# EAGLE design bilancia_smart_no_route (EAGLE 7.1.0)
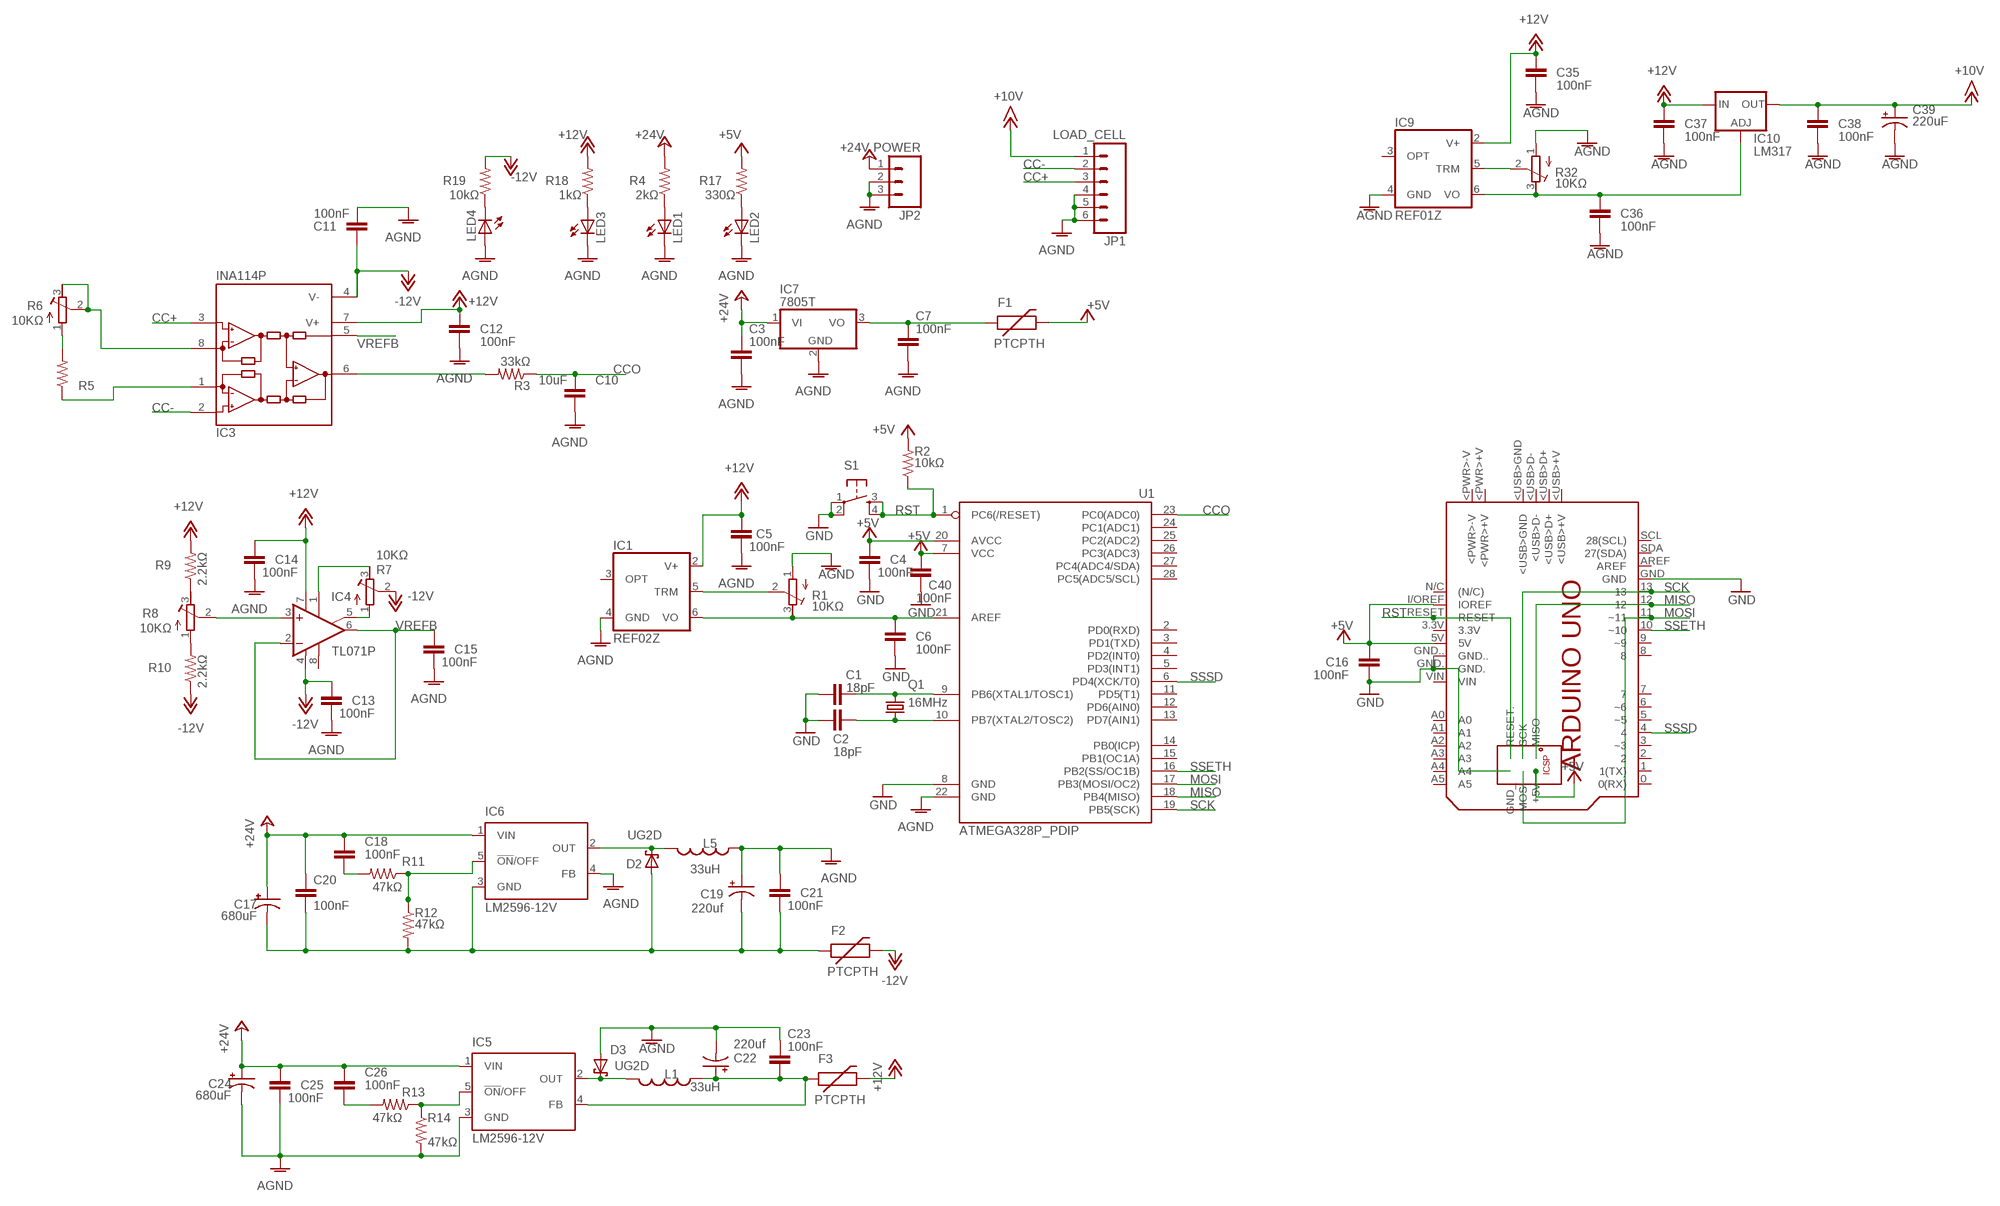
[diagram p0: schematic, sheet 1]

## Parts
C1  18pF  C2.5/2  [C2.5-2]
C2  18pF  C2.5/2  [C2.5-2]
C3  100nF  C2.5/2  [C2.5-2]
C4  100nF  C2.5/2  [C2.5-2]
C5  100nF  C2.5/2  [C2.5-2]
C6  100nF  C2.5/2  [C2.5-2]
C7  100nF  C2.5/2  [C2.5-2]
C10  10uF  C2.5/2  [C2.5-2]
C11  100nF  C2.5/2  [C2.5-2]
C12  100nF  C2.5/2  [C2.5-2]
C13  100nF  C2.5/2  [C2.5-2]
C14  100nF  C2.5/2  [C2.5-2]
C15  100nF  C2.5/2  [C2.5-2]
C16  100nF  C2.5/2  [C2.5-2]
C17  680uF  CPOL-USE5-8.5  [E5-8,5]
C18  100nF  C2.5/2  [C2.5-2]
C19  220uf  CPOL-USE5-8.5  [E5-8,5]
C20  100nF  C2.5/2  [C2.5-2]
C21  100nF  C2.5/2  [C2.5-2]
C22  220uf  CPOL-USE5-8.5  [E5-8,5]
C23  100nF  C2.5/2  [C2.5-2]
C24  680uF  CPOL-USE5-8.5  [E5-8,5]
C25  100nF  C2.5/2  [C2.5-2]
C26  100nF  C2.5/2  [C2.5-2]
C35  100nF  C2.5/2  [C2.5-2]
C36  100nF  C2.5/2  [C2.5-2]
C37  100nF  C2.5/2  [C2.5-2]
C38  100nF  C2.5/2  [C2.5-2]
C39  220uF  CAP_POLPTH1  [CPOL-RADIAL-100UF-25V]
C40  100nF  C2.5/2  [C2.5-2]
D2  UG2D  SCHOTTKY-DIODEDO41-7  [DO41-7]
D3  UG2D  SCHOTTKY-DIODEDO41-7  [DO41-7]
F1  PTCPTH  [PTC]
F2  PTCPTH  [PTC]
F3  PTCPTH  [PTC]
IC1  REF02Z  [DIL08]
IC3  INA114P  [DIL08]
IC4  TL071P  [DIL08]
IC5  LM2596-12V  LM2596T  [T05D]
IC6  LM2596-12V  LM2596T  [T05D]
IC7  7805T  [TO220H]
IC9  REF01Z  [DIL08]
IC10  LM317  LM317TS  [317TS]
JP1  LOAD_CELL  M06SIP  [1X06]
JP2  POWER  M03PTH  [1X03]
L1  33uH  INDUCTORRLB0912  [RLB0912]
L5  33uH  INDUCTORRLB0912  [RLB0912]
LED1  MINIMIDI_LED5MM  [MINIMIDI_LED5MM]
LED2  MINIMIDI_LED5MM  [MINIMIDI_LED5MM]
LED3  MINIMIDI_LED5MM  [MINIMIDI_LED5MM]
LED4  MINIMIDI_LED5MM  [MINIMIDI_LED5MM]
PCB1  ARDUINO_UNO  [ARDUINO_UNO]
Q1  16MHz  CRYSTALHC49S  [HC49/S]
R1  10KΩ  R-TRIMM64W  [RTRIM64W]
R2  10kΩ  R-US_0207/10  [0207/10]
R3  33kΩ  R-US_0207/10  [0207/10]
R4  2kΩ  R-US_0207/10  [0207/10]
R5  R-US_0207/10  [0207/10]
R6  10KΩ  R-TRIMM64W  [RTRIM64W]
R7  10KΩ  R-TRIMM64W  [RTRIM64W]
R8  10KΩ  R-TRIMM64W  [RTRIM64W]
R9  2.2kΩ  R-US_0207/10  [0207/10]
R10  2.2kΩ  R-US_0207/10  [0207/10]
R11  47kΩ  R-US_0207/2V  [0207/2V]
R12  47kΩ  R-US_0207/2V  [0207/2V]
R13  47kΩ  R-US_0207/2V  [0207/2V]
R14  47kΩ  R-US_0207/2V  [0207/2V]
R17  330Ω  R-US_0207/10  [0207/10]
R18  1kΩ  R-US_0207/10  [0207/10]
R19  10kΩ  R-US_0207/10  [0207/10]
R32  10KΩ  R-TRIMM64W  [RTRIM64W]
S1  TAC_SWITCHPTH  [TACTILE-PTH]
U1  ATMEGA328P_PDIP  [DIL28-3]

## Nets
+5V: C4.2 C16.2 C40.2 F1.P$2 PCB1.5V PCB1.+5V PCB1.I/OREF(IOREF) R2.2 R17.2 U1.7(VCC) U1.20(AVCC)
+12V: C5.1 C12.2 C14.2 C35.2 C37.2 F3.P$2 IC1.2(V+) IC3.7(V+) IC4.7(V+) IC9.2(V+) IC10.3(IN) R9.2 R18.2
+15V: C38.2 C39.1(+) IC10.2(OUT) JP1.1 ; supply symbol labelled +10V
+24V: C3.2 C17.+ C18.1 C20.1 C24.+ C25.1 C26.1 IC5.1(VIN) IC6.1(VIN) IC7.1(VI) JP2.1 R4.2
-12V: C11.2 C13.2 F2.P$2 IC3.4(V-) IC4.4(V-) R7.2(S) R10.1 R19.2
AGND: C3.1 C5.2 C7.1 C10.1 C11.1 C12.1 C13.1 C14.1 C15.1 C19.+ C21.1 C22.- C23.2 C24.- C25.2 C35.1 C36.1 C37.1 C38.1 C39.2(-) D3.A IC1.4(GND) IC5.3(GND) IC6.4(FB) IC7.2(GND) IC9.4(GND) JP1.4 JP1.5 JP1.6 JP2.2 JP2.3 L5.1 LED1.K(C) LED2.K(C) LED3.K(C) LED4.A R1.1(E) R14.2 R32.1(E) U1.22(GND)
CC+: IC3.3(+IN) JP1.3
CC-: IC3.2(-IN) JP1.2
CCO: C10.2 R3.1 U1.23(PC0(ADC0))
GND: C1.1 C2.1 C4.1 C6.1 C16.1 C40.1 PCB1.GND PCB1.GND. PCB1.GND.. PCB1.GND_ S1.1 S1.2 U1.8(GND)
MISO: PCB1.12 PCB1.MISO U1.18(PB4(MISO))
MOSI: PCB1.11(~11) PCB1.MOSI U1.17(PB3(MOSI/OC2))
N$1: C6.2 IC1.6(VO) R1.3(A) U1.21(AREF)
N$2: C2.2 Q1.2 U1.10(PB7(XTAL2/TOSC2))
N$3: C1.2 Q1.1 U1.9(PB6(XTAL1/TOSC1))
N$4: LED2.A R17.1
N$5: IC1.5(TRM) R1.2(S)
N$6: C7.2 F1.P$1 IC7.3(VO)
N$7: IC3.6(OUT) R3.2
N$8: LED1.A R4.1
N$9: R5.2 R6.1(E)
N$10: IC3.8(RG) R6.2(S) R6.3(A)
N$11: IC3.1(RG) R5.1
N$12: IC4.5(ON2) R7.1(E)
N$13: IC4.1(ON1) R7.3(A)
N$14: IC6.5(!ON!/OFF) R11.1 R12.1
N$15: R8.3(A) R9.1
N$16: R8.1(E) R10.2
N$17: IC4.3(+IN) R8.2(S)
N$18: C18.2 R11.2
N$20: D2.C IC6.2(OUT) L5.2
N$21: C22.+ C23.1 F3.P$1 IC5.4(FB) L1.1
N$22: C17.- C19.- C20.2 C21.2 D2.A F2.P$1 IC6.3(GND) R12.2
N$23: D3.C IC5.2(OUT) L1.2
N$24: IC5.5(!ON!/OFF) R13.1 R14.1
N$25: C26.2 R13.2
N$28: LED3.A R18.1
N$29: LED4.K(C) R19.1
N$42: C36.2 IC9.6(VO) IC10.1(ADJ) R32.3(A)
N$43: IC9.5(TRM) R32.2(S)
RST: PCB1.RESET PCB1.RESET. R2.1 S1.3 S1.4 U1.1(PC6(/RESET))
SCK: PCB1.13 PCB1.SCK U1.19(PB5(SCK))
SSETH: PCB1.10(~10) U1.16(PB2(SS/OC1B))
SSSD: PCB1.4 U1.6(PD4(XCK/T0))
VREFB: C15.2 IC3.5(REF) IC4.2(-IN) IC4.6(OUT)
Unconnected: IC1.3(OPT) IC4.8(OPT) IC9.3(OPT) PCB1.0(0(RX)) PCB1.1(1(TX)) PCB1.2 PCB1.3(~3) PCB1.3.3V PCB1.5(~5) PCB1.6(~6) PCB1.7 PCB1.8 PCB1.9(~9) PCB1.<PWR>+V PCB1.<PWR>-V PCB1.<USB>+V PCB1.<USB>D+ PCB1.<USB>D- PCB1.<USB>GND PCB1.A0 PCB1.A1 PCB1.A2 PCB1.A3 PCB1.A4 PCB1.A5 PCB1.AREF PCB1.N/C((N/C)) PCB1.SCL(28(SCL)) PCB1.SDA(27(SDA)) PCB1.VIN U1.2(PD0(RXD)) U1.3(PD1(TXD)) U1.4(PD2(INT0)) U1.5(PD3(INT1)) U1.11(PD5(T1)) U1.12(PD6(AIN0)) U1.13(PD7(AIN1)) U1.14(PB0(ICP)) U1.15(PB1(OC1A)) U1.24(PC1(ADC1)) U1.25(PC2(ADC2)) U1.26(PC3(ADC3)) U1.27(PC4(ADC4/SDA)) U1.28(PC5(ADC5/SCL))

## Library data of the parts
C1-C7 C10-C16 C18 C20 C21 C23 C25 C26 C35-C38 C40 = capacitor-wima:C: CAPACITOR naming: grid - package width
C17 C19 C22 C24 = resistor:CPOL-US: POLARIZED CAPACITOR, American symbol
C39 = SparkFun-Capacitors:CAP_POL: Capacitor Polarized These are standard SMD and PTH capacitors. Normally 10uF, 47uF, and 100uF in electrolytic and tantalum varieties. Always verify the external diameter of the through hole cap, it varies with capacity, voltage, and manufacturer. The EIA devices should be standard.
D2 D3 = adafruit:SCHOTTKY-DIODE: Schottky Diode
F1-F3 = SparkFun-PowerIC:PTC: Resettable Fuse PTC Resettable Fuse. Spark Fun Electronics SKU : COM-08357
IC1 = linear:REF02: VOLTAGE REFERENCE
IC3 = burr-brown:INA114: Precision Instrumentation Amplifier; MF: TEXAS INSTRUMENTS; MPN: INA114BP; OC_FARNELL: 1212399; OC_NEWARK: 74K3810
IC4 = linear:TL071: OP AMP
IC5 IC6 = national-semiconductor:LM2596: SIMPLE SWITCHER® Power Converter 150 kHz 3A Step-Down Voltage Regulator Source: http://www.national.com/ds/LM/LM2596.pdf; MPN: LM2596T-ADJ/LF02; OC_FARNELL: 9494162; OC_NEWARK: 65K5910
IC7 = linear:78*: Positive VOLTAGE REGULATOR Source: http://cache.national.com/ds/LM/LM78L05.pdf http://www.fairchildsemi.com/ds/LM/LM7805.pdf
IC9 = linear:REF01: VOLTAGE REFERENCE
IC10 = v-reg:LM317TS: VOLTAGE REGULATOR
JP1 = SparkFun-Connectors:M06: Header 6 Standard 6-pin 0.1" header. Use with straight break away headers (SKU : PRT-00116), right angle break away headers (PRT-00553), swiss pins (PRT-00743), machine pins (PRT-00117), and female headers (PRT-00115). Molex polarized connector foot print use with SKU : PRT-08094 with associated crimp pins and housings. NOTES ON THE VARIANTS LOCK and LOCK_LONGPADS... This footprint was designed to help hold the alignment of a through-hole component (i.e. 6-pin header) while soldering it into place. You may notice that each hole has been shifted either up or down by 0.005 of an inch from it's more standard position (which is a perfectly straight line). This slight alteration caused the pins (the squares in the middle) to touch the edges of the holes. Because they are alternating, it causes a "brace" to hold the component in place. 0.005 has proven to be the perfect amount of "off-center" position when using our standard breakaway headers. Although looks a little odd when you look at the bare footprint, once you have a header in there, the alteration is very hard to notice. Also,if you push a header all the way into place, it is covered up entirely on the bottom side. This idea of altering the position of holes to aid alignment will be further integrated into the Sparkfun Library for other footprints. It can help hold any component with 3 or more connection pins.
JP2 = SparkFun-Connectors:M03: Header 3 Standard 3-pin 0.1" header. Use with straight break away headers (SKU : PRT-00116), right angle break away headers (PRT-00553), swiss pins (PRT-00743), machine pins (PRT-00117), and female headers (PRT-00115). Molex polarized connector foot print use with SKU : PRT-08232 with associated crimp pins and housings.
L1 L5 = SparkFun-Passives:INDUCTOR: Inductors Basic Inductor/Choke - 0603 and 1206. Footprints are not proven and vary greatly between part numbers. SRN6045- 33uH, 20% 1.4A
LED1-LED4 = AF_mshield-v1 (1):MINIMIDI_LED: LED OSRAM: - CHIPLED LG R971, LG N971, LY N971, LG Q971, LY Q971, LO R971, LY R971 LH N974, LH R974 LS Q976, LO Q976, LY Q976 LO Q996 - Hyper CHIPLED LW Q18S LB Q993, LB Q99A, LB R99A - SideLED LS A670, LO A670, LY A670, LG A670, LP A670 LB A673, LV A673, LT A673, LW A673 LH A674 LY A675 LS A676, LA A676, LO A676, LY A676, LW A676 LS A679, LY A679, LG A679 - Hyper Micro SIDELED® LS Y876, LA Y876, LO Y876, LY Y876 LT Y87S - SmartLED LW L88C, LW L88S LB L89C, LB L89S, LG L890 LS L89K, LO L89K, LY L89K LS L896, LA L896, LO L896, LY L896 - TOPLED LS T670, LO T670, LY T670, LG T670, LP T670 LSG T670, LSP T670, LSY T670, LOP T670, LYG T670 LG T671, LOG T671, LSG T671 LB T673, LV T673, LT T673, LW T673 LH T674 LS T676, LA T676, LO T676, LY T676, LB T676, LH T676, LSB T676, LW T676 LB T67C, LV T67C, LT T67C, LS T67K, LO T67K, LY T67K, LW E67C LS E67B, LA E67B, LO E67B, LY E67B, LB E67C, LV E67C, LT E67C LW T67C LS T679, LY T679, LG T679 LS T770, LO T770, LY T770, LG T770, LP T770 LB T773, LV T773, LT T773, LW T773 LH T774 LS E675, LA E675, LY E675, LS T675 LS T776, LA T776, LO T776, LY T776, LB T776 LHGB T686 LT T68C, LB T68C - Hyper Mini TOPLED® LB M676 - Mini TOPLED Santana® LG M470 LS M47K, LO M47K, LY M47K Source: http://www.osram.convergy.de/
PCB1 = E14_Arduino:ARDUINO_UNO: Device for representing an Arduino Uno board with a footprint in an EAGLE design. Created by Dave Young for Element14. More EAGLE documentation at: http://www.element14.com/community/community/knode/cadsoft_eagle
Q1 = adafruit:CRYSTAL: CRYSTAL; OC_FARNELL: 1667008; OC_NEWARK: unknown
R1 R6-R8 R32 = resistor:R-TRIMM: Trimm resistor
R2-R5 R9-R14 R17-R19 = resistor:R-US_: RESISTOR, American symbol
S1 = SparkFun-Electromechanical:TAC_SWITCH: Momentary Switch Button commonly used for reset or general input. Spark Fun Electronics SKU : COM-00097 SMT- SWCH-08247
U1 = SparkFun-DigitalIC:ATMEGA328P_PDIP: uC used in the Arduino 32kb flash, 1k EEPROM, 2k SRAM This is the through-hole version of this chip.

## Board
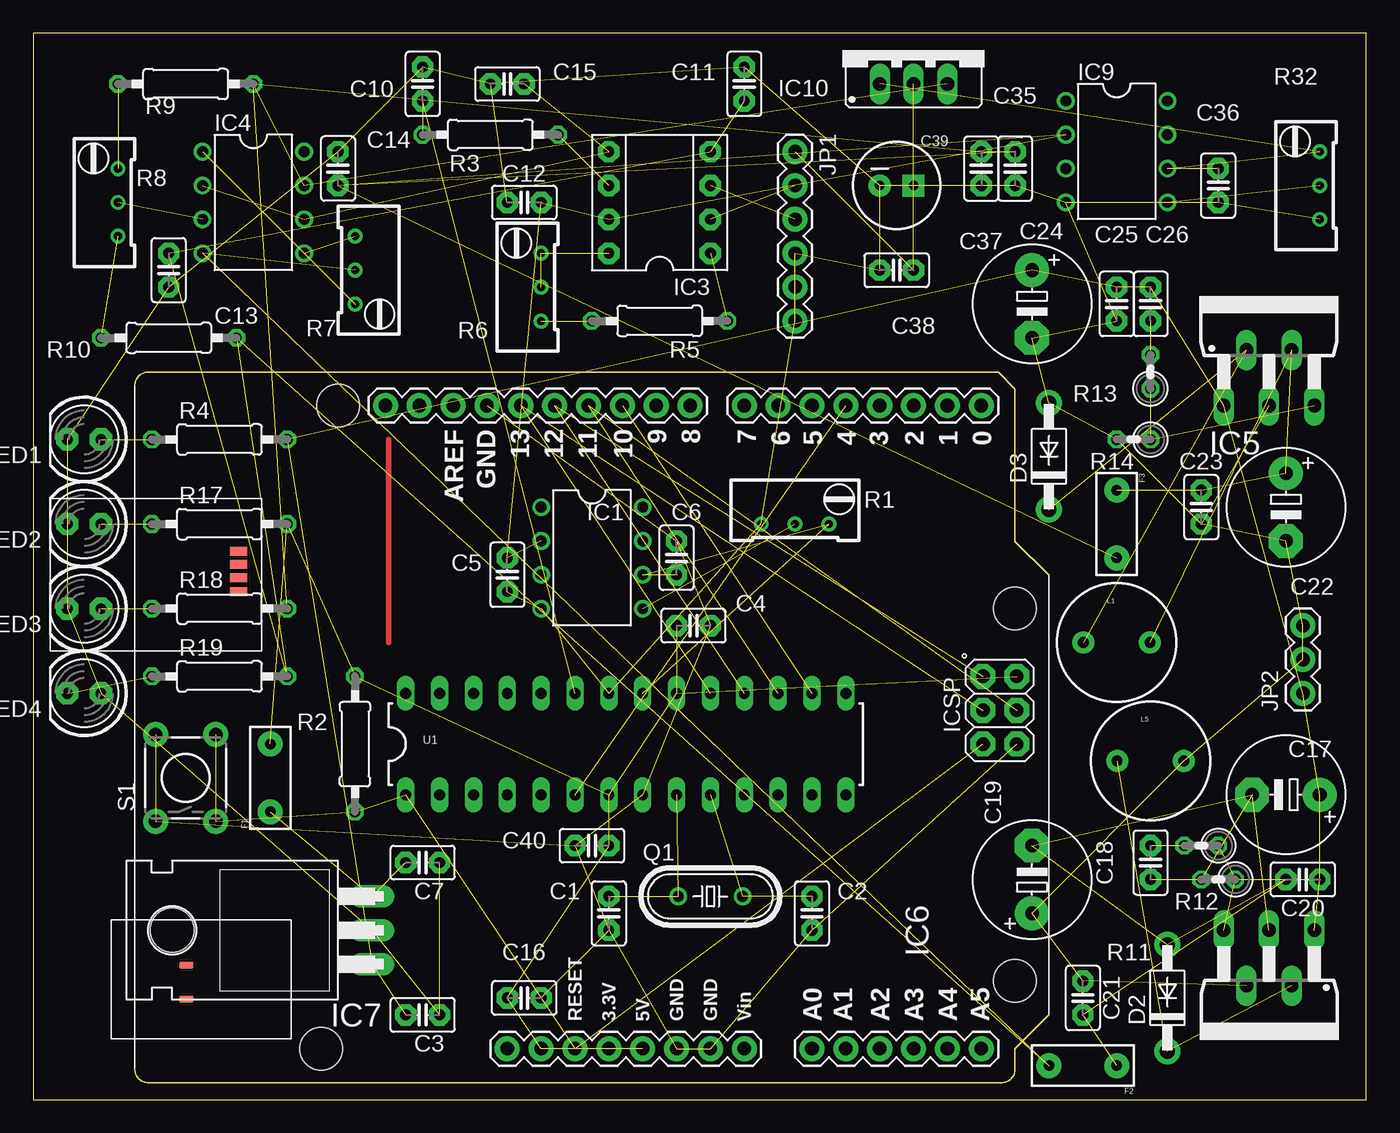
[diagram p1: board, top side]
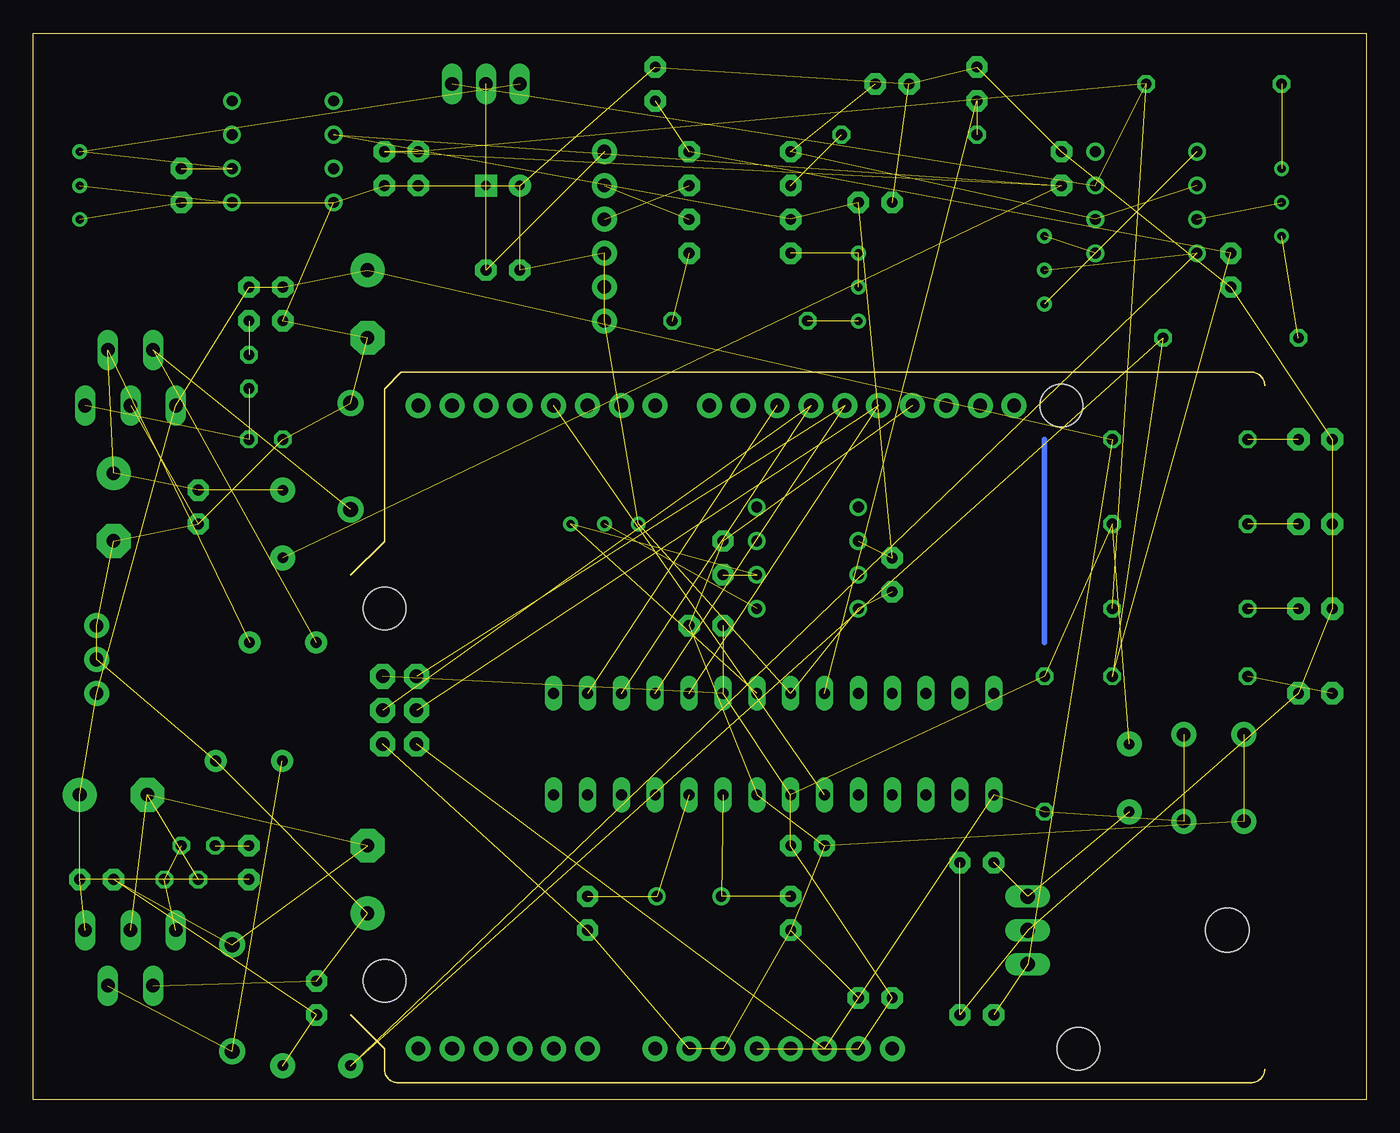
[diagram p2: board, bottom side, seen from below]

Size 100 x 80 mm. Coordinates in mm from the lower left corner, seen from the top.
Outline: 0,0 100,0 100,80 0,80 0,0
Copper layers (1*16): Top 0.035mm / dielectric 1.5mm / Bottom 0.035mm
Design rules "default": minimum track width 10mil, minimum drill 24mil, track to track 8mil, track to pad 8mil, pad to pad 8mil, via to via 8mil, smd to smd 8mil, copper to edge 40mil, drill to drill 8mil, minimum pad ring 10mil, minimum via ring 8mil, stop-mask expansion 4mil, vias tented up to drill 0mil, thermal gap 10mil

### Footprints (pad centres in the part's own frame; a part is rotated, then mirrored left to right if it is on the bottom)
C2.5-2 = drill 0.813 pad 1.6 octagon: 1 -1.27,0; 2 1.27,0
E5-8,5 = drill 1.016 pad 2.54: + -2.54,0 | drill 1.016 pad 2.54 octagon: - 2.54,0
CPOL-RADIAL-100UF-25V = drill 0.7 pad 1.651 square: 1 1.27,0 | drill 0.7 pad 1.651: 2 -1.27,0
DO41-7 = drill 1.118 pad 1.93: A 4,0; C -4,0
PTC = drill 0.8 pad 1.88: P$1 -2.54,0; P$2 2.54,0
DIL08 = drill 0.813 pad 1.27: 1 -3.81,-3.81; 2 -1.27,-3.81; 3 1.27,-3.81; 4 3.81,-3.81; 5 3.81,3.81; 6 1.27,3.81; 7 -1.27,3.81; 8 -3.81,3.81
DIL08' = drill 0.813 pad 1.6 octagon: 1 -3.81,-3.81; 2 -1.27,-3.81; 3 1.27,-3.81; 4 3.81,-3.81; 5 3.81,3.81; 6 1.27,3.81; 7 -1.27,3.81; 8 -3.81,3.81
T05D = drill 1.016 long: 1 -3.404,-5.08; 2 -1.702,-0.914; 3 0,-5.08; 4 1.702,-0.914; 5 3.404,-5.08
TO220H = drill 1.118 long: 1 -2.54,-10.16; 2 0,-10.16; 3 2.54,-10.16 | hole 3.302: 0,4.826
317TS = drill 1.016 long: 1 -2.54,-2.54; 2 0,-2.54; 3 2.54,-2.54
1X06 = drill 1.016 pad 1.88: 1 0,0; 2 2.54,0; 3 5.08,0; 4 7.62,0; 5 10.16,0; 6 12.7,0
1X03 = drill 1.016 pad 1.88: 1 0,0; 2 2.54,0; 3 5.08,0
RLB0912 = drill 0.813 pad 1.651: 1 2.502,0; 2 -2.502,0
MINIMIDI_LED5MM = drill 0.813 pad 1.676 octagon: A -1.27,0; K 1.27,0
ARDUINO_UNO = drill 1.016 pad 1.88: 0 63.5,50.8; 1 60.96,50.8; 2 58.42,50.8; 3 55.88,50.8; 3.3V 35.56,2.54; 4 53.34,50.8; 5 50.8,50.8; 5V 38.1,2.54; 6 48.26,50.8; 7 45.72,50.8; 8 41.656,50.8; 9 39.116,50.8; 10 36.576,50.8; 11 34.036,50.8; 12 31.496,50.8; 13 28.956,50.8; A0 50.8,2.54; A1 53.34,2.54; A2 55.88,2.54; A3 58.42,2.54; A4 60.96,2.54; A5 63.5,2.54; AREF 23.876,50.8; GND 26.416,50.8; GND. 43.18,2.54; GND.. 40.64,2.54; I/OREF 30.48,2.54; N/C 27.94,2.54; RESET 33.02,2.54; SCL 18.796,50.8; SDA 21.336,50.8; VIN 45.72,2.54 | drill 1.016 pad 1.88 octagon: +5V 66.167,30.48; GND_ 66.167,25.4; MISO 63.627,30.48; MOSI 66.167,27.94; RESET. 63.627,25.4; SCK 63.627,27.94 | smd 1.016 x 0.508: <PWR>+V 3.861,8.814; <PWR>-V 3.861,6.274 | smd 1.27 x 0.635: <USB>+V 7.772,39.878; <USB>D+ 7.772,38.887; <USB>D- 7.772,37.871; <USB>GND 7.772,36.83 | hole 3.2: 66.04,7.62; 66.04,35.56; 15.24,50.8; 13.97,2.54
HC49/S = drill 0.813: 1 -2.413,0; 2 2.413,0
RTRIM64W = drill 0.61: 1 1.27,-2.54; 2 1.27,0; 3 1.27,2.54
0207/10 = drill 0.813 octagon: 1 -5.08,0; 2 5.08,0
0207/2V = drill 0.813 octagon: 1 -1.27,0; 2 1.27,0
TACTILE-PTH = drill 1.016 pad 1.88: 1 -3.251,2.261; 2 3.251,2.261; 3 -3.251,-2.261; 4 3.251,-2.261
DIL28-3 = drill 0.813 long: 1 -16.51,-3.81; 2 -13.97,-3.81; 3 -11.43,-3.81; 4 -8.89,-3.81; 5 -6.35,-3.81; 6 -3.81,-3.81; 7 -1.27,-3.81; 8 1.27,-3.81; 9 3.81,-3.81; 10 6.35,-3.81; 11 8.89,-3.81; 12 11.43,-3.81; 13 13.97,-3.81; 14 16.51,-3.81; 15 16.51,3.81; 16 13.97,3.81; 17 11.43,3.81; 18 8.89,3.81; 19 6.35,3.81; 20 3.81,3.81; 21 1.27,3.81; 22 -1.27,3.81; 23 -3.81,3.81; 24 -6.35,3.81; 25 -8.89,3.81; 26 -11.43,3.81; 27 -13.97,3.81; 28 -16.51,3.81

### Placement (x,y rotation side)
C1  43.18,13.97 90 top
C2  58.42,13.97 90 top
C3  29.21,6.35 180 top
C4  49.53,35.56 180 top
C5  35.56,39.37 270 top
C6  48.26,40.64 270 top
C7  29.21,17.78 180 top
C10  29.21,76.2 270 top
C11  53.34,76.2 270 top
C12  36.83,67.31 0 top
C13  10.16,62.23 90 top
C14  22.86,69.85 270 top
C15  35.56,76.2 0 top
C16  36.83,7.62 180 top
C17  93.98,22.86 180 top
C18  83.82,17.78 90 top
C19  74.93,16.51 90 top
C20  95.25,16.51 180 top
C21  78.74,7.62 270 top
C22  93.98,44.45 270 top
C23  87.63,44.45 270 top
C24  74.93,59.69 270 top
C25  81.28,59.69 270 top
C26  83.82,59.69 270 top
C35  73.66,69.85 90 top
C36  88.9,68.58 90 top
C37  71.12,69.85 90 top
C38  64.77,62.23 0 top
C39  64.77,68.58 0 top
C40  41.91,19.05 0 top
D2  85.09,7.62 90 top
D3  76.2,48.26 90 top
F1  17.78,24.13 90 top
F2  78.74,2.54 180 top
F3  81.28,43.18 270 top
IC1  41.91,40.64 270 top
IC3  INA114P  [DIL08']  46.99,67.31 90 top
IC4  16.51,67.31 270 top
IC5  92.71,57.15 0 top
IC6  92.71,7.62 180 top
IC7  15.24,12.7 90 top
IC9  81.28,71.12 270 top
IC10  66.04,78.74 0 top
JP1  57.15,71.12 270 top
JP2  95.25,30.48 90 top
L1  81.28,34.29 0 top
L5  83.82,25.4 0 top
LED1  3.81,49.53 180 top
LED2  3.81,43.18 180 top
LED3  3.81,36.83 180 top
LED4  3.81,30.48 180 top
PCB1  7.62,1.27 0 top
Q1  50.8,15.24 0 top
R1  57.15,44.45 270 top
R2  24.13,26.67 90 top
R3  34.29,72.39 0 top
R4  13.97,49.53 0 top
R5  46.99,58.42 180 top
R6  36.83,60.96 0 top
R7  25.4,62.23 180 top
R8  5.08,67.31 0 top
R9  11.43,76.2 0 top
R10  10.16,57.15 180 top
R11  87.63,19.05 180 top
R12  88.9,16.51 180 top
R13  83.82,54.61 90 top
R14  82.55,49.53 180 top
R17  13.97,43.18 0 top
R18  13.97,36.83 0 top
R19  13.97,31.75 0 top
R32  95.25,68.58 0 top
S1  11.43,24.13 90 top
U1  44.45,26.67 0 top

### Tracks (layer width: path | path; a pad name or v marks a point on that pad's centre or on a via)
+5V  (10 unrouted)
+12V  (12 unrouted)
+15V  (3 unrouted)
+24V  (11 unrouted)
-12V  (7 unrouted)
AGND  (39 unrouted)
CC+  (1 unrouted)
CC-  (1 unrouted)
CCO  (2 unrouted)
GND  (12 unrouted)
MISO  (2 unrouted)
MOSI  (2 unrouted)
N$1  (3 unrouted)
N$2  (2 unrouted)
N$3  (2 unrouted)
N$4  (1 unrouted)
N$5  (1 unrouted)
N$6  (2 unrouted)
N$7  (1 unrouted)
N$8  (1 unrouted)
N$9  (1 unrouted)
N$10  (2 unrouted)
N$11  (1 unrouted)
N$12  (1 unrouted)
N$13  (1 unrouted)
N$14  (2 unrouted)
N$15  (1 unrouted)
N$16  (1 unrouted)
N$17  (1 unrouted)
N$18  (1 unrouted)
N$20  (2 unrouted)
N$21  (4 unrouted)
N$22  (7 unrouted)
N$23  (2 unrouted)
N$24  (2 unrouted)
N$25  (1 unrouted)
N$28  (1 unrouted)
N$29  (1 unrouted)
N$30
  Bottom 0.406: 24.13,34.29 24.13,49.53
N$31
  Top 0.406: 26.67,34.29 26.67,49.53
N$42  (3 unrouted)
N$43  (1 unrouted)
RST  (5 unrouted)
SCK  (2 unrouted)
SSETH  (1 unrouted)
SSSD  (1 unrouted)
VREFB  (3 unrouted)